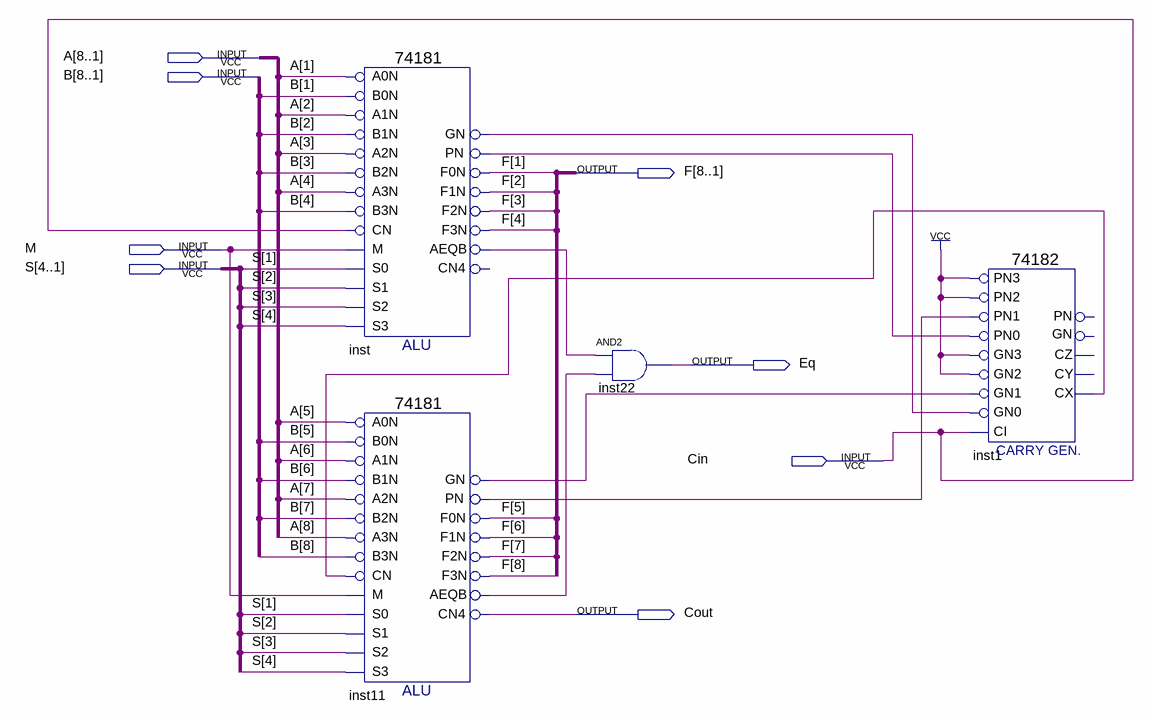
[diagram p0: schematic sheet]
// Quartus schematic alu8b_fc_sch.bdf as structural Verilog: 4 symbols, 8 pins
module alu8b_fc_sch (
  input  [8:1] A,
  input  [8:1] B,
  input  M,
  input  [4:1] S,
  input  Cin,
  output [8:1] F,
  output Eq,
  output Cout
);

  wire inst1_cx, inst11_aeqb, inst11_gn, inst11_pn, inst_aeqb, inst_gn, inst_pn;

  \74181  inst (
    .B0N(B[1]), .A0N(A[1]), .A1N(A[2]), .B1N(B[2]), .A3N(A[4]), .B2N(B[3]), .A2N(A[3]), .M(M), .CN(Cin),
    .B3N(B[4]), .S2(S[3]), .S1(S[2]), .S0(S[1]), .S3(S[4]), .PN(inst_pn), .GN(inst_gn), .F3N(F[4]),
    .F1N(F[2]), .F0N(F[1]), .AEQB(inst_aeqb), .F2N(F[3]));  // open: CN4
  \74181  inst11 (
    .B0N(B[5]), .A0N(A[5]), .A1N(A[6]), .B1N(B[6]), .A3N(A[8]), .B2N(B[7]), .A2N(A[7]), .M(M), .CN(inst1_cx),
    .B3N(B[8]), .S2(S[3]), .S1(S[2]), .S0(S[1]), .S3(S[4]), .PN(inst11_pn), .GN(inst11_gn), .F3N(F[8]),
    .F1N(F[6]), .F0N(F[5]), .AEQB(inst11_aeqb), .CN4(Cout), .F2N(F[7]));
  and inst22 (Eq, inst_aeqb, inst11_aeqb);
  \74182  inst1 (
    .PN2(1'b1), .GN2(1'b1), .GN3(1'b1), .PN3(1'b1), .CI(Cin), .PN1(inst11_pn), .PN0(inst_pn),
    .GN1(inst11_gn), .GN0(inst_gn), .CX(inst1_cx));  // open: CY, PN, CZ, GN
endmodule
